# Altium schematic sheet IPMI.SchDoc
size A4; DocumentNumber: 5; SheetNumber: 5; SheetTotal: 30
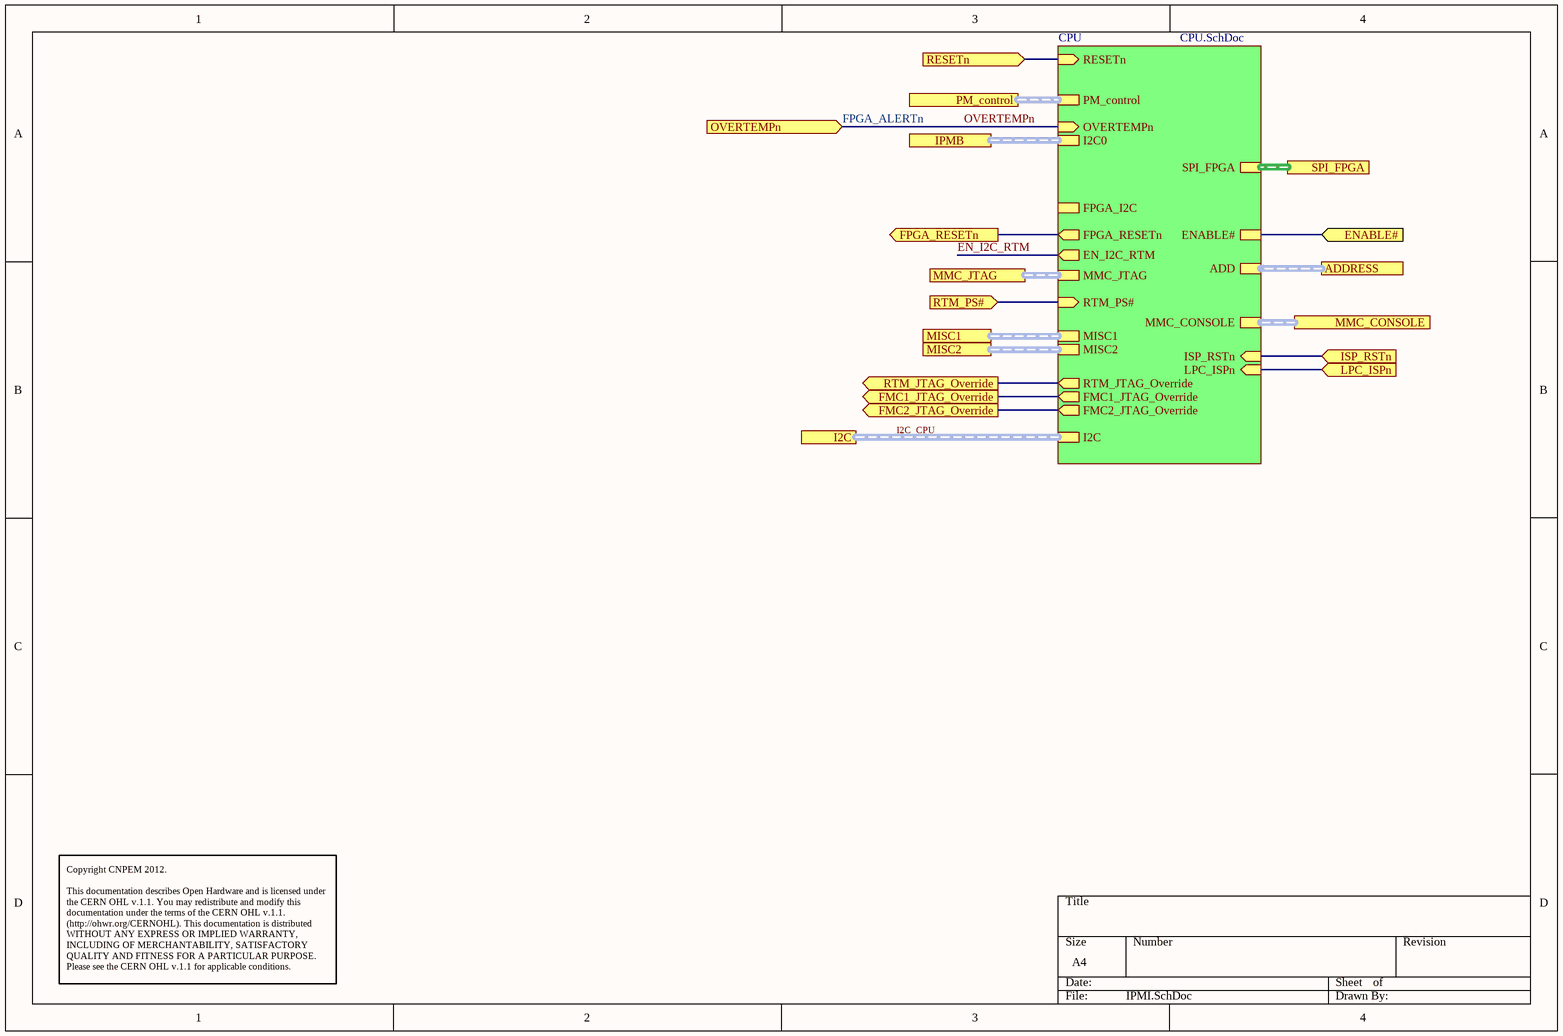
[diagram p0: IPMI.SchDoc]

## Sub-sheets
CPU = CPU.SchDoc: ENABLE#, PM_control (harness PM_control), OVERTEMPn (in), SPI_FPGA (harness SPI), RESETn (in), I2C (harness I2C), I2C0 (harness I2C), MISC1 (harness MISC), MISC2 (harness MISC), ADD (harness AMC_ADD), FPGA_RESETn (out), RTM_PS# (in), EN_I2C_RTM (out), FPGA_I2C (harness I2C), RTM_JTAG_Override (out), FMC1_JTAG_Override (out), FMC2_JTAG_Override (out), MMC_JTAG (harness JTAG), ISP_RSTn (in), LPC_ISPn (in), MMC_CONSOLE (harness UART)

## Ports
ADDRESS (harness AMC_ADD), ENABLE# (in), FMC1_JTAG_Override (out), FMC2_JTAG_Override (out), FPGA_RESETn (out), I2C (harness I2C), IPMB (harness I2C), ISP_RSTn (in), LPC_ISPn (in), MISC1 (harness MISC), MISC2 (harness MISC), MMC_CONSOLE (harness UART), MMC_JTAG (harness JTAG), OVERTEMPn (in), PM_control (harness PM_control), RESETn (in), RTM_JTAG_Override (out), RTM_PS# (in), SPI_FPGA (harness SPI)

## Nets
EN_I2C_RTM: sheet CPU/EN_I2C_RTM
ENABLE#: port ENABLE#, sheet CPU/ENABLE#
FMC1_JTAG_Override: port FMC1_JTAG_Override, sheet CPU/FMC1_JTAG_Override
FMC2_JTAG_Override: port FMC2_JTAG_Override, sheet CPU/FMC2_JTAG_Override
FPGA_ALERTn: port OVERTEMPn, sheet CPU/OVERTEMPn  [also labelled OVERTEMPn]
FPGA_RESETn: port FPGA_RESETn, sheet CPU/FPGA_RESETn
ISP_RSTn: port ISP_RSTn, sheet CPU/ISP_RSTn
LPC_ISPn: port LPC_ISPn, sheet CPU/LPC_ISPn
RESETn: port RESETn, sheet CPU/RESETn
RTM_JTAG_Override: port RTM_JTAG_Override, sheet CPU/RTM_JTAG_Override
RTM_PS#: port RTM_PS#, sheet CPU/RTM_PS#

## Buses and harness runs
harness I2C_CPU = port I2C = sheet CPU/I2C
harness port ADDRESS = sheet CPU/ADD
harness port IPMB = sheet CPU/I2C0
harness port MISC1 = sheet CPU/MISC1
harness port MISC2 = sheet CPU/MISC2
harness port MMC_CONSOLE = sheet CPU/MMC_CONSOLE
harness port MMC_JTAG = sheet CPU/MMC_JTAG
harness port PM_control = sheet CPU/PM_control
harness port SPI_FPGA = sheet CPU/SPI_FPGA

## Notes on the sheet
- Copyright CNPEM 2012.
  This documentation describes Open Hardware and is licensed under the CERN OHL v.1.1. You may redistribute and modify this documentation under the terms of the CERN OHL v.1.1. (http://ohwr.org/CERNOHL). This documentation is distributed WITHOUT ANY EXPRESS OR IMPLIED WARRANTY, INCLUDING OF MERCHANTABILITY, SATISFACTORY QUALITY AND FITNESS FOR A PARTICULAR PURPOSE. Please see the CERN OHL v.1.1 for applicable conditions.